# EAGLE schematic FULLMONI-WIDE_LED-Board1_SCH (EAGLE 9.7.0)
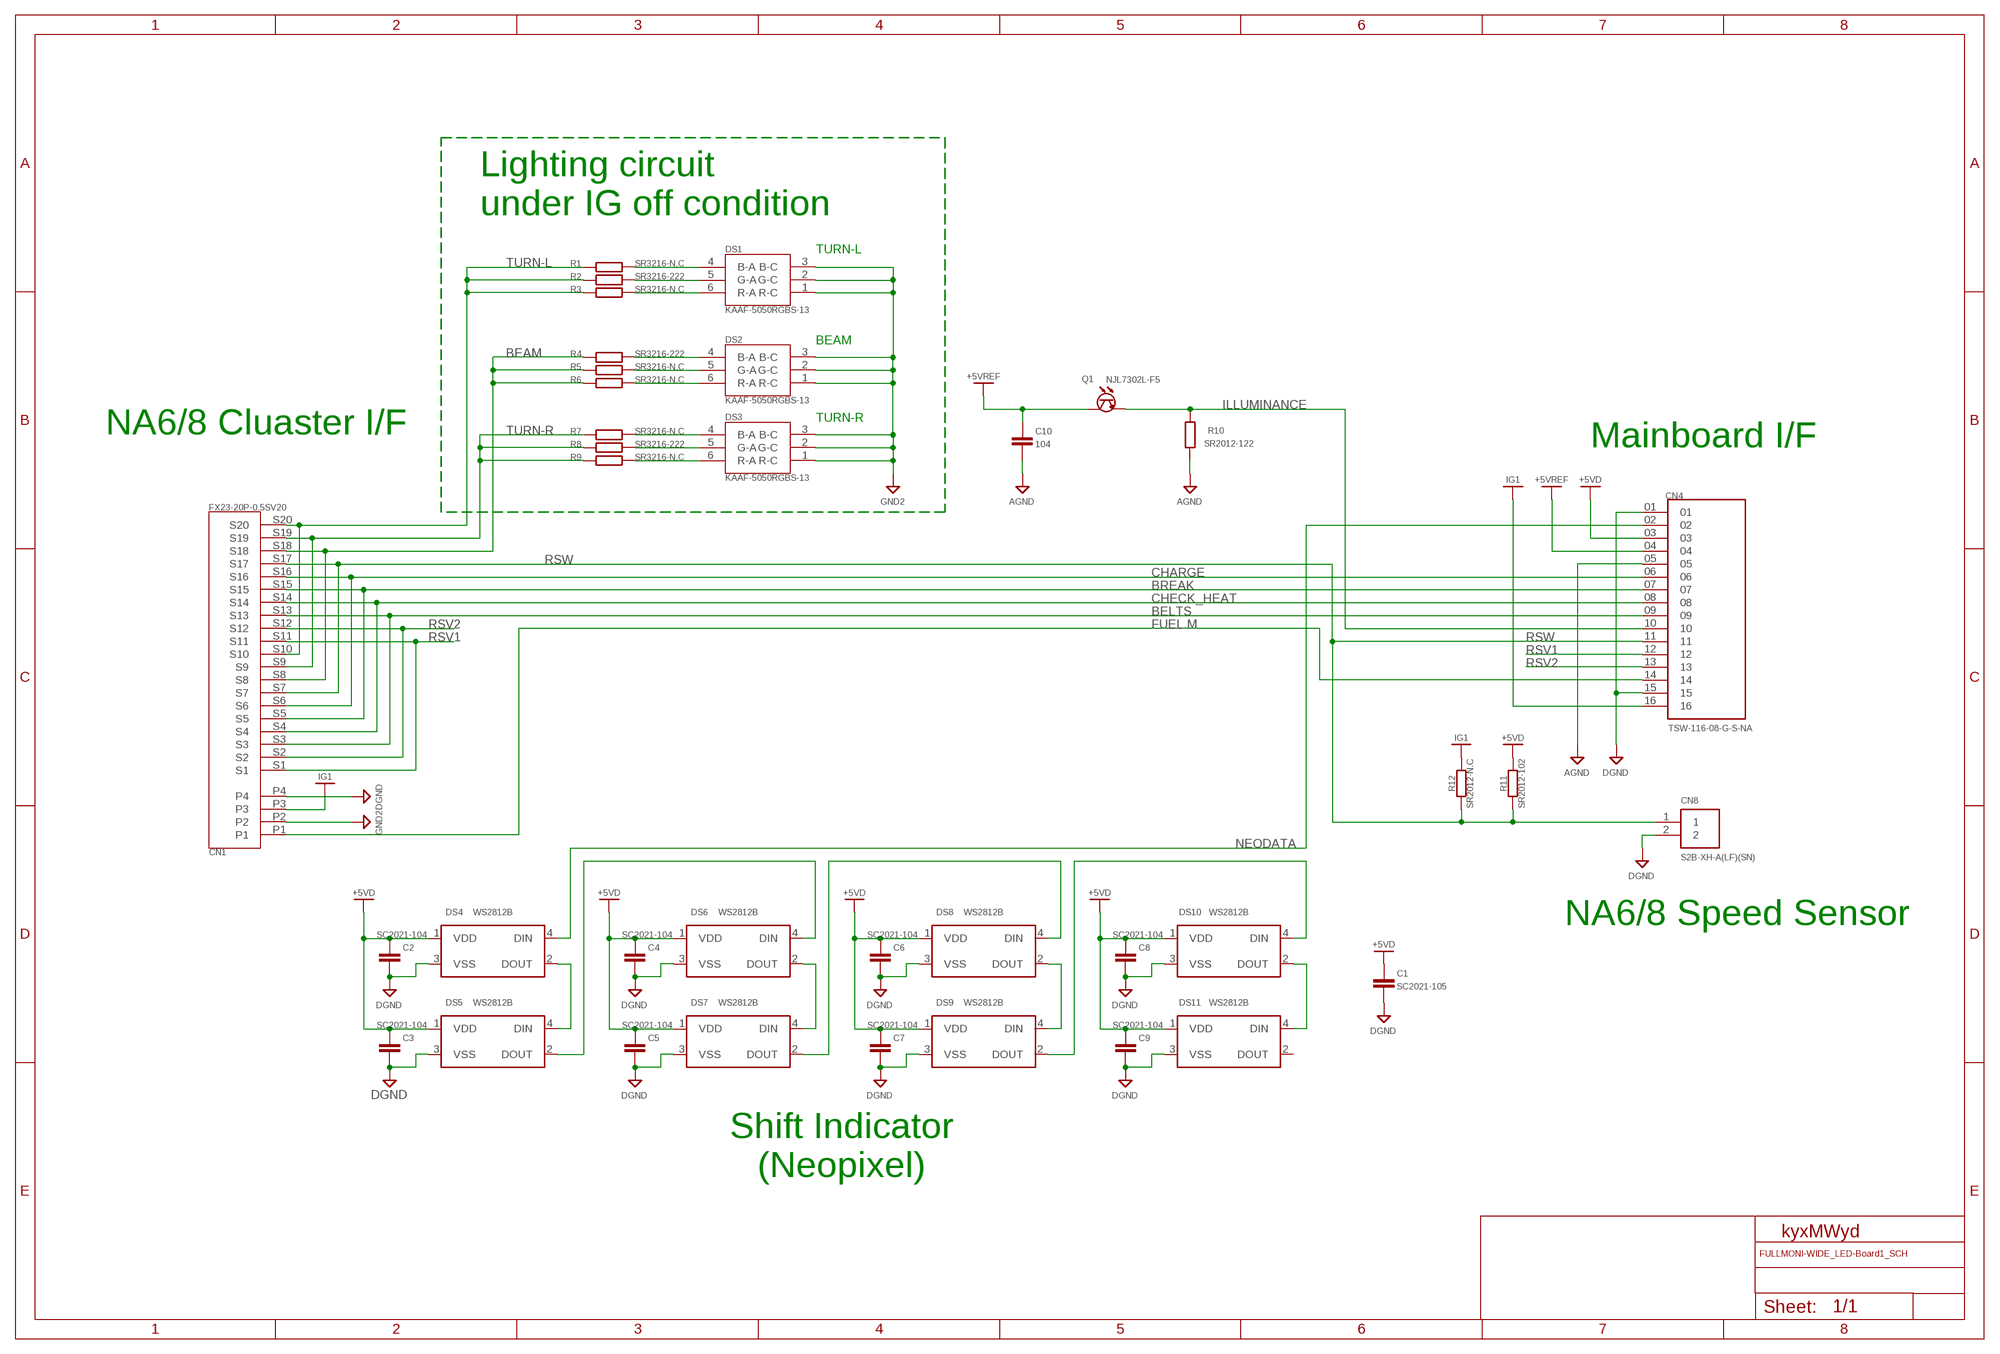
[diagram p0: schematic, sheet 1]

## Parts
C1  SC2021-105  C_CHIP-1210(3225-METRIC)  [CAPC3225X135]
C2  SC2021-104  C_CHIP-0805(2012-METRIC)  [CAPC2012X110]
C3  SC2021-104  C_CHIP-0805(2012-METRIC)  [CAPC2012X110]
C4  SC2021-104  C_CHIP-0805(2012-METRIC)  [CAPC2012X110]
C5  SC2021-104  C_CHIP-0805(2012-METRIC)  [CAPC2012X110]
C6  SC2021-104  C_CHIP-0805(2012-METRIC)  [CAPC2012X110]
C7  SC2021-104  C_CHIP-0805(2012-METRIC)  [CAPC2012X110]
C8  SC2021-104  C_CHIP-0805(2012-METRIC)  [CAPC2012X110]
C9  SC2021-104  C_CHIP-0805(2012-METRIC)  [CAPC2012X110]
C10  104  C_CHIP-0805(2012-METRIC)  [CAPC2012X110]
CN1  FX23-20P-0.5SV20  [FX23-20P-0.5SV20]
CN4  TSW-116-08-G-S-NA  [SAMTEC_TSW-116-08-G-S-NA]
CN8  S2B-XH-A(LF)(SN)  [HDR-02/RA]
DS1  KAAF-5050RGBS-13  [KAAF-5050RGBS-13]
DS2  KAAF-5050RGBS-13  [KAAF-5050RGBS-13]
DS3  KAAF-5050RGBS-13  [KAAF-5050RGBS-13]
DS4  WS2812B  [WS2812B]
DS5  WS2812B  [WS2812B]
DS6  WS2812B  [WS2812B]
DS7  WS2812B  [WS2812B]
DS8  WS2812B  [WS2812B]
DS9  WS2812B  [WS2812B]
DS10  WS2812B  [WS2812B]
DS11  WS2812B  [WS2812B]
Q1  NJL7302L-F5  [NJL7302L-F5]
R1  SR3216-N.C  R-EU_R3216  [R3216]
R2  SR3216-222  R-EU_R3216  [R3216]
R3  SR3216-N.C  R-EU_R3216  [R3216]
R4  SR3216-222  R-EU_R3216  [R3216]
R5  SR3216-N.C  R-EU_R3216  [R3216]
R6  SR3216-N.C  R-EU_R3216  [R3216]
R7  SR3216-N.C  R-EU_R3216  [R3216]
R8  SR3216-222  R-EU_R3216  [R3216]
R9  SR3216-N.C  R-EU_R3216  [R3216]
R10  SR2012-122  R_CHIP-0805(2012-METRIC)  [RESC2012X65]
R11  SR2012-102  R_CHIP-0805(2012-METRIC)  [RESC2012X65]
R12  SR2012-N.C  R_CHIP-0805(2012-METRIC)  [RESC2012X65]

## Nets
+5VD: C1.1 C2.1 C3.1 C4.1 C5.1 C6.1 C7.1 C8.1 C9.1 CN4.03 DS4.1(VDD) DS5.1(VDD) DS6.1(VDD) DS7.1(VDD) DS8.1(VDD) DS9.1(VDD) DS10.1(VDD) DS11.1(VDD) R11.2 ; supply symbol labelled +V
+5VREF: C10.1 CN4.04 Q1.P$2(C) ; supply symbol labelled +V
AGND: C10.2 CN4.05 R10.1
BEAM: CN1.S8 CN1.S18 R4.1 R5.1 R6.1
BELTS: CN1.S3 CN1.S13 CN4.09
BREAK: CN1.S5 CN1.S15 CN4.07
CHARGE: CN1.S6 CN1.S16 CN4.06
CHECK_HEAT: CN1.S4 CN1.S14 CN4.08
DGND: C1.2 C2.2 C3.2 C4.2 C5.2 C6.2 C7.2 C8.2 C9.2 CN1.P4 CN4.01 CN4.15 CN8.2 DS4.3(VSS) DS5.3(VSS) DS6.3(VSS) DS7.3(VSS) DS8.3(VSS) DS9.3(VSS) DS10.3(VSS) DS11.3(VSS)
FUEL.M: CN1.P1 CN4.14
GND2: CN1.P2 DS1.1(R-C) DS1.2(G-C) DS1.3(B-C) DS2.1(R-C) DS2.2(G-C) DS2.3(B-C) DS3.1(R-C) DS3.2(G-C) DS3.3(B-C)
IG1: CN1.P3 CN4.16 R12.2 ; supply symbol labelled +V
ILLUMINANCE: CN4.10 Q1.P$1(E) R10.2
N$1: DS1.4(B-A) R1.2
N$2: DS3.4(B-A) R7.2
N$3: DS2.4(B-A) R4.2
N$4: DS1.5(G-A) R2.2
N$5: DS1.6(R-A) R3.2
N$6: DS3.5(G-A) R8.2
N$7: DS3.6(R-A) R9.2
N$9: DS2.5(G-A) R5.2
N$10: DS2.6(R-A) R6.2
N$11: DS4.2(DOUT) DS5.4(DIN)
N$12: DS5.2(DOUT) DS6.4(DIN)
N$13: DS6.2(DOUT) DS7.4(DIN)
N$14: DS7.2(DOUT) DS8.4(DIN)
N$15: DS8.2(DOUT) DS9.4(DIN)
N$16: DS9.2(DOUT) DS10.4(DIN)
N$17: DS10.2(DOUT) DS11.4(DIN)
NEODATA: CN4.02 DS4.4(DIN)
RSV1: CN1.S1 CN1.S11 CN4.12
RSV2: CN1.S2 CN1.S12 CN4.13
RSW: CN1.S7 CN1.S17 CN4.11 CN8.1 R11.1 R12.1
TURN-L: CN1.S10 CN1.S20 R1.1 R2.1 R3.1
TURN-R: CN1.S9 CN1.S19 R7.1 R8.1 R9.1
Unconnected: DS11.2(DOUT)

## Notes on the sheet
- Lighting circuit
  under IG off condition
- TURN-L
- BEAM
- TURN-R
- NA6/8 Cluaster I/F
- Mainboard I/F
- NA6/8 Speed Sensor
- Shift Indicator
  (Neopixel)

## Library data of the parts
C1-C10 = Capacitor:C: Capacitor - Generic; CATEGORY: Capacitor
CN1 = ECADライブラリ:FX23-20P-0.5SV20
CN4 = ECADライブラリ:TSW-116-08-G-S-NA; MANUFACTURER: Samtec; PARTREV: R; STANDARD: Manufacturer Recommendations
CN8 = Connectors:S2B-XH-A(LF)(SN): CONN HEADER R/A 2POS 2.5MM Manufacturer's datasheet <http://www.jst-mfg.com/product/pdf/eng/eXH.pdf>; CREATED_BY: PCBLayout.com; DIGIKEY_PART_NUMBER: 455-2257-ND; MANUFACTURER: JST Sales America Inc.; MPN: S2B-XH-A(LF)(SN)
DS1-DS3 = ECADライブラリ:KAAF-5050RGBS-13
DS4-DS11 = ECADライブラリ:WS2812B: Intelligent control LED integrated light source Datasheet <http://cdn.sparkfun.com/datasheets/BreakoutBoards/WS2812B.pdf>; CATEGORY: LED; COLOR: RGB; DESCRIPTION: LED integrated light source; MANUFACTURER: Worldsemi; MPN: WS2812B; OPERATING_TEMP: -25 ℃ to +80℃(TJ); PART_STATUS: Active; SUB_CATEGORY: RGB
Q1 = ECADライブラリ:NJL7302L-F5
R1-R9 = rcl:R-EU_: RESISTOR, European symbol; SPICEPREFIX: R
R10-R12 = Resistor:R: Resistor Fixed - Generic; CATEGORY: Resistor; SUB-CATEGORY: Fixed